# EAGLE design FPGA Interface Board (EAGLE 6.5.0)
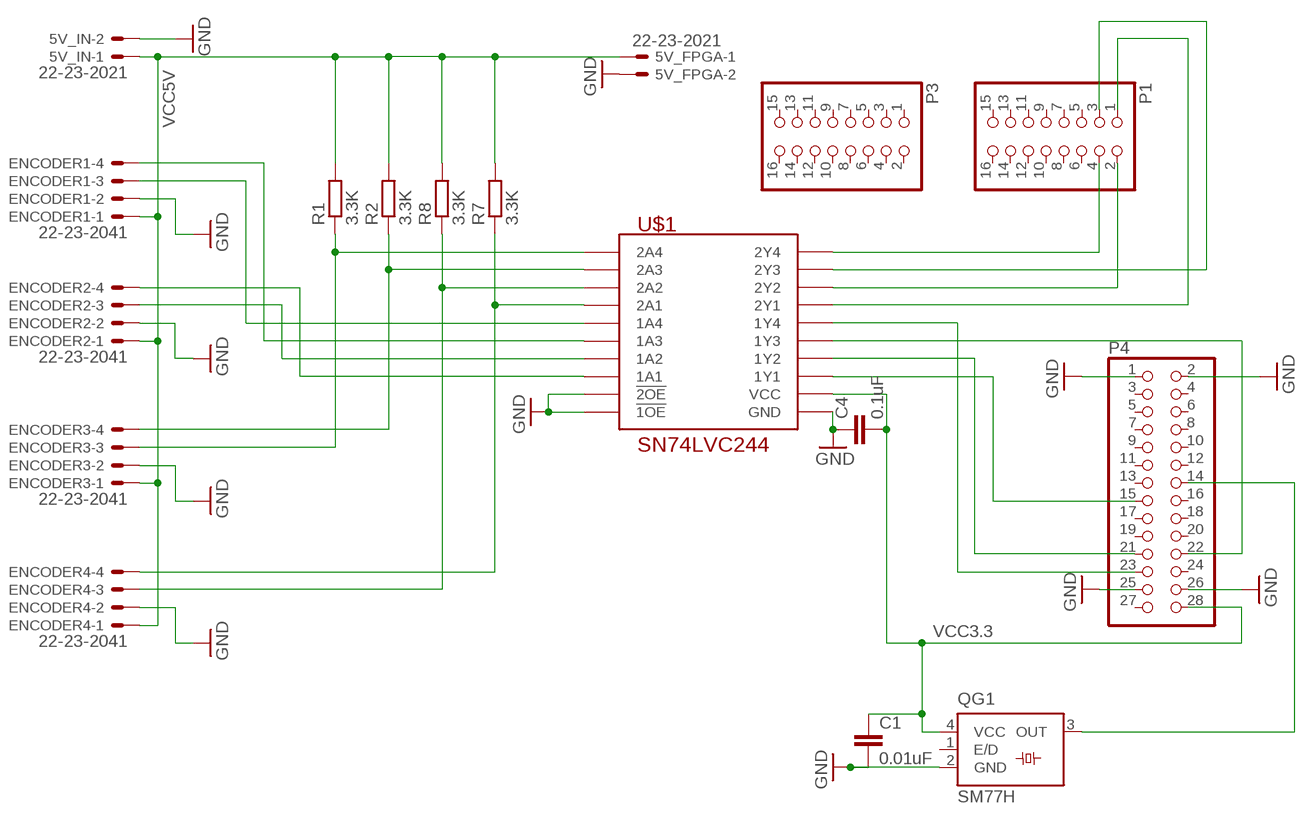
[diagram p0: schematic, sheet 1]

## Parts
5V_FPGA  22-23-2021  [22-23-2021]
5V_IN  22-23-2021  [22-23-2021]
C1  0.01uF  C-EUC0603  [C0603]
C4  0.1uF  C-EUC0603  [C0603]
ENCODER1  22-23-2041  [22-23-2041]
ENCODER2  22-23-2041  [22-23-2041]
ENCODER3  22-23-2041  [22-23-2041]
ENCODER4  22-23-2041  [22-23-2041]
P1  PINHD-2X8  [2X08]
P3  PINHD-2X8  [2X08]
P4  PINHD-2X14  [2X14]
QG1  SM77H  [SM77H]
R1  3.3K  R-EU_R0603  [R0603]
R2  3.3K  R-EU_R0603  [R0603]
R7  3.3K  R-EU_R0603  [R0603]
R8  3.3K  R-EU_R0603  [R0603]
U$1  SN74LVC244  [TSSOP-20-0.65MM]

## Nets
GND: 5V_FPGA.2 5V_IN.2 C1.2 C4.1 ENCODER1.2 ENCODER2.2 ENCODER3.2 ENCODER4.2 P4.1 P4.2 P4.25 P4.26 QG1.2(GND) U$1.P$1(!1OE) U$1.P$10(GND) U$1.P$19(!2OE)
N$1: P4.14 QG1.3(OUT)
N$2: P4.23 U$1.P$12(1Y4)
N$3: P4.21 U$1.P$16(1Y2)
N$4: P4.15 U$1.P$18(1Y1)
N$5: P4.22 U$1.P$14(1Y3)
N$6: P1.4 U$1.P$3(2Y4)
N$7: P1.2 U$1.P$7(2Y2)
N$8: P1.1 U$1.P$9(2Y1)
N$9: P1.3 U$1.P$5(2Y3)
N$10: ENCODER3.3 R1.1 U$1.P$17(2A4)
N$11: ENCODER3.4 R2.1 U$1.P$15(2A3)
N$14: ENCODER4.3 R8.1 U$1.P$13(2A2)
N$15: ENCODER4.4 R7.1 U$1.P$11(2A1)
N$16: ENCODER1.3 U$1.P$8(1A4)
N$17: ENCODER1.4 U$1.P$6(1A3)
N$18: ENCODER2.3 U$1.P$4(1A2)
N$19: ENCODER2.4 U$1.P$2(1A1)
VCC3.3: C1.1 C4.2 P4.28 QG1.4(VCC) U$1.P$20(VCC)
VCC5V: 5V_FPGA.1 5V_IN.1 ENCODER1.1 ENCODER2.1 ENCODER3.1 ENCODER4.1 R1.2 R2.2 R7.2 R8.2
Unconnected: P1.5 P1.6 P1.7 P1.8 P1.9 P1.10 P1.11 P1.12 P1.13 P1.14 P1.15 P1.16 P3.1 P3.2 P3.3 P3.4 P3.5 P3.6 P3.7 P3.8 P3.9 P3.10 P3.11 P3.12 P3.13 P3.14 P3.15 P3.16 P4.3 P4.4 P4.5 P4.6 P4.7 P4.8 P4.9 P4.10 P4.11 P4.12 P4.13 P4.16 P4.17 P4.18 P4.19 P4.20 P4.24 P4.27 QG1.1(E/D)

## Library data of the parts
5V_FPGA 5V_IN = con-molex:22-23-2021: .100" (2.54mm) Center Header - 2 Pin; MF: MOLEX; MPN: 22-23-2021; OC_FARNELL: 1462926; OC_NEWARK: 25C3832
C1 C4 = rcl:C-EU: CAPACITOR, European symbol
ENCODER1-ENCODER4 = con-molex:22-23-2041: .100" (2.54mm) Center Header - 4 Pin; MF: MOLEX; MPN: 22-23-2041; OC_FARNELL: 1462920; OC_NEWARK: 38C0355
P1 P3 = pinhead:PINHD-2X8: PIN HEADER
P4 = pinhead:PINHD-2X14: PIN HEADER
QG1 = custom:SM77H: 3.3V CMOS Clock Oscillator Source: www.pletronics.com .. sm77h%203.3v.pdf; OC_FARNELL: unknown; OC_NEWARK: unknown
R1 R2 R7 R8 = rcl:R-EU_: RESISTOR, European symbol
U$1 = custom:SN74LVC244

## Board
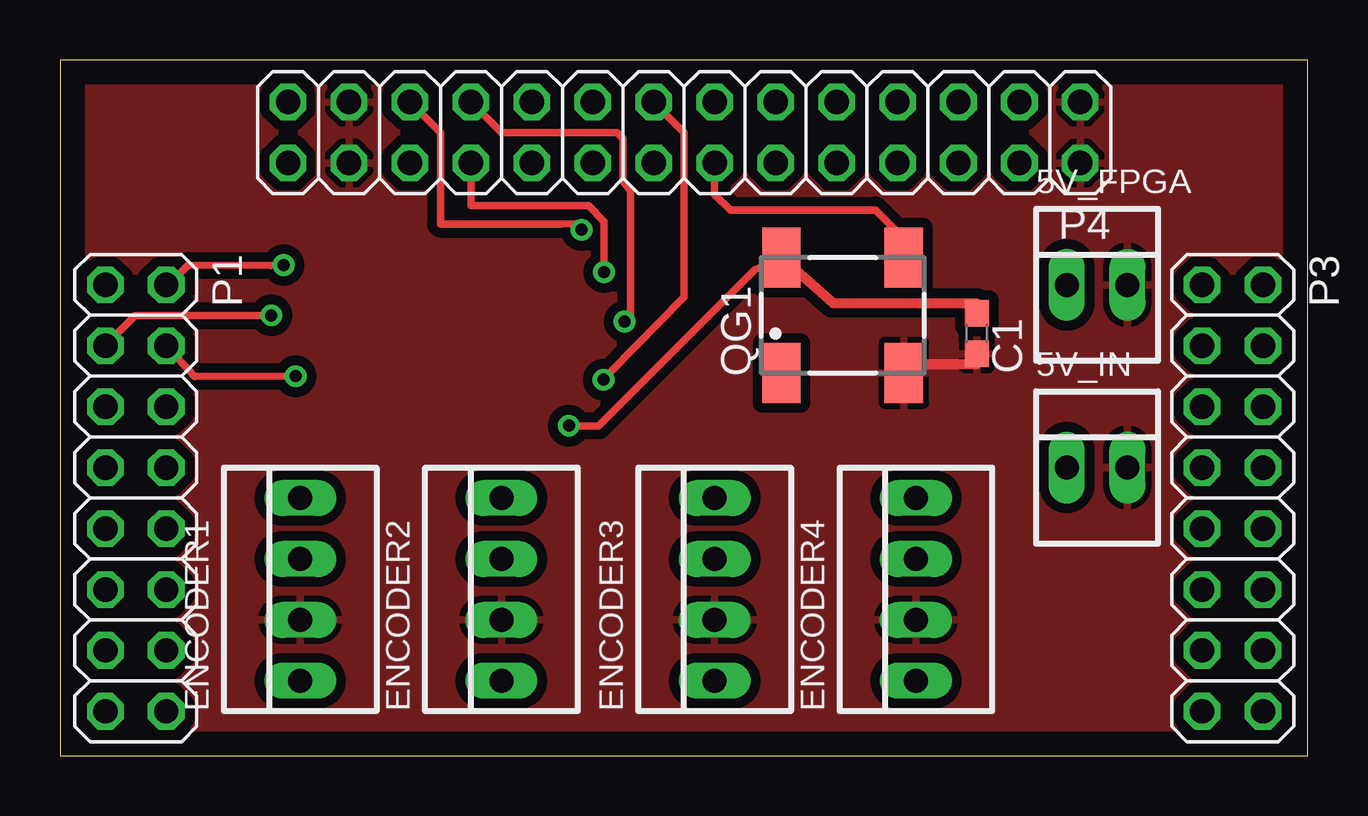
[diagram p1: board, top side]
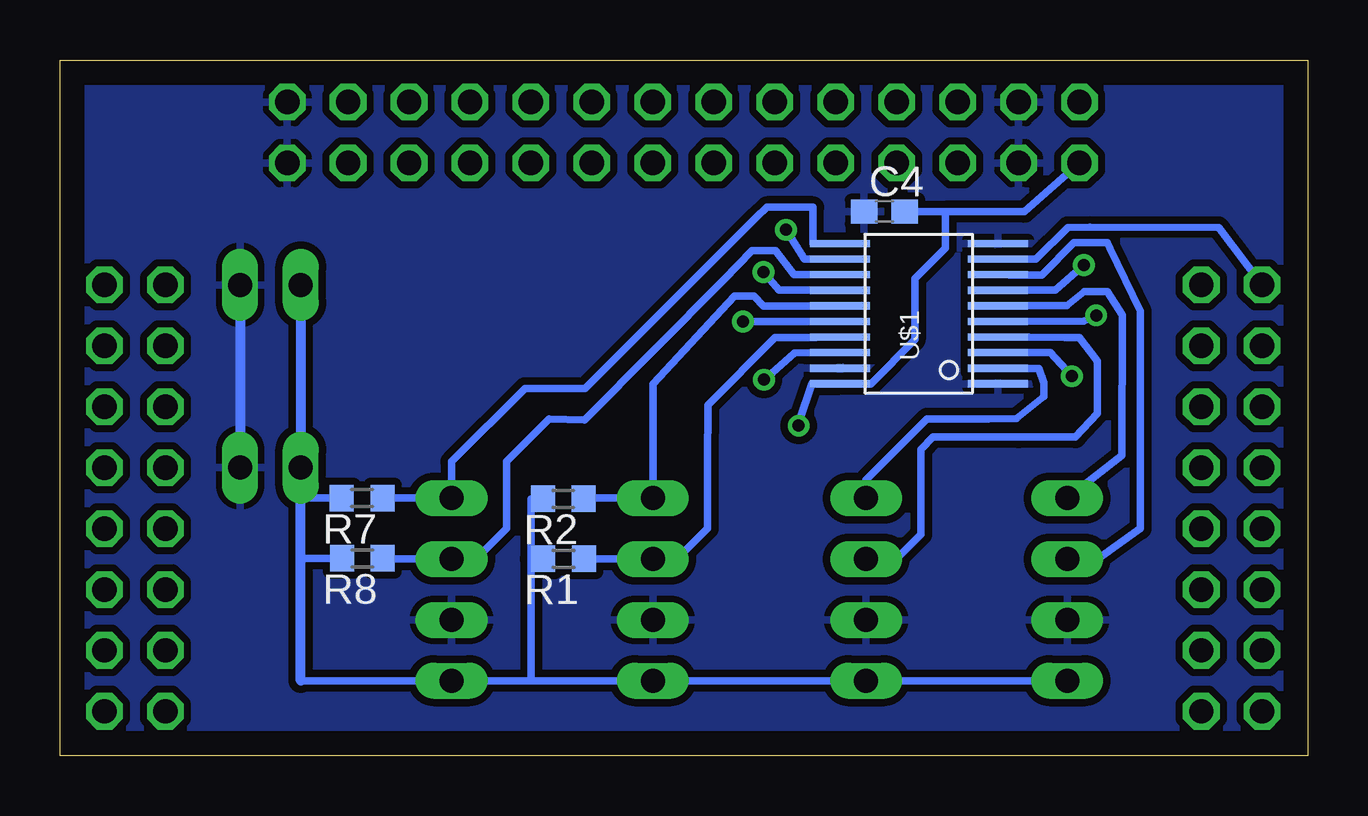
[diagram p2: board, bottom side, seen from below]

Size 52 x 29 mm. Coordinates in mm from the lower left corner, seen from the top.
Outline: 0,0 52,0 52,29 0,29 0,0
Copper layers (1*16): Top 0.035mm / dielectric 1.5mm / Bottom 0.035mm
Design rules "default *": minimum track width 8mil, minimum drill 0.3mm, track to track 8mil, track to pad 8mil, pad to pad 8mil, via to via 8mil, smd to smd 8mil, copper to edge 40mil, drill to drill 8mil, minimum pad ring 10mil, minimum via ring 8mil, stop-mask expansion 4mil, vias tented up to drill 0mil, thermal gap 10mil

### Footprints (pad centres in the part's own frame; a part is rotated, then mirrored left to right if it is on the bottom)
22-23-2021 = drill 1 long: 1 -1.27,0; 2 1.27,0
C0603 = smd 1.1 x 1: 1 -0.85,0; 2 0.85,0
22-23-2041 = drill 1 long: 1 -3.81,0; 2 -1.27,0; 3 1.27,0; 4 3.81,0
2X08 = drill 1.016 octagon: 1 -8.89,-1.27; 2 -8.89,1.27; 3 -6.35,-1.27; 4 -6.35,1.27; 5 -3.81,-1.27; 6 -3.81,1.27; 7 -1.27,-1.27; 8 -1.27,1.27; 9 1.27,-1.27; 10 1.27,1.27; 11 3.81,-1.27; 12 3.81,1.27; 13 6.35,-1.27; 14 6.35,1.27; 15 8.89,-1.27; 16 8.89,1.27
2X14 = drill 1.016 octagon: 1 -16.51,-1.27; 2 -16.51,1.27; 3 -13.97,-1.27; 4 -13.97,1.27; 5 -11.43,-1.27; 6 -11.43,1.27; 7 -8.89,-1.27; 8 -8.89,1.27; 9 -6.35,-1.27; 10 -6.35,1.27; 11 -3.81,-1.27; 12 -3.81,1.27; 13 -1.27,-1.27; 14 -1.27,1.27; 15 1.27,-1.27; 16 1.27,1.27; 17 3.81,-1.27; 18 3.81,1.27; 19 6.35,-1.27; 20 6.35,1.27; 21 8.89,-1.27; 22 8.89,1.27; 23 11.43,-1.27; 24 11.43,1.27; 25 13.97,-1.27; 26 13.97,1.27; 27 16.51,-1.27; 28 16.51,1.27
SM77H = smd 1.6 x 2.5: 1 -2.55,-2.4; 2 2.55,-2.4; 3 2.55,2.4; 4 -2.55,2.4
R0603 = smd 1 x 1.1: 1 -0.85,0; 2 0.85,0
TSSOP-20-0.65MM = smd 0.3 x 2.5: P$1 -2.925,-3.3; P$2 -2.275,-3.3; P$3 -1.625,-3.3; P$4 -0.975,-3.3; P$5 -0.325,-3.3; P$6 0.325,-3.3; P$7 0.975,-3.3; P$8 1.625,-3.3; P$9 2.275,-3.3; P$10 2.925,-3.3; P$11 2.925,3.3; P$12 2.275,3.3; P$13 1.625,3.3; P$14 0.975,3.3; P$15 0.325,3.3; P$16 -0.325,3.3; P$17 -0.975,3.3; P$18 -1.625,3.3; P$19 -2.275,3.3; P$20 -2.925,3.3

### Placement (x,y rotation side)
5V_FPGA  43.23,19.62 0 top
5V_IN  43.23,12 0 top
C1  38.21,17.59 270 top
C4  17.64,22.67 0 bottom
ENCODER1  10.02,6.92 90 top
ENCODER2  18.4,6.92 90 top
ENCODER3  27.29,6.92 90 top
ENCODER4  35.68,6.92 90 top
P1  3.16,10.73 270 top
P3  48.88,10.73 270 top
P4  26.02,25.97 180 top
QG1  32.62,18.35 0 top
R1  31.01,8.21 180 bottom
R2  31.02,10.7 180 bottom
R7  39.4,10.73 180 bottom
R8  39.4,8.22 180 bottom
U$1  16.2,18.42 90 bottom

### Tracks (layer width: path | path; a pad name or v marks a point on that pad's centre or on a via)
GND
  Top 0.406: QG1.2 36.07,16.32 38.21,16.32 C1.2
  Bottom 0.406: 5V_FPGA.2 5V_IN.2
  pour Bottom (isolate 0.305): 0,28 0,0 51,0 51,28
  pour Top (isolate 0.406): 0,28 51,28 51,0 0,0
N$1
  Top 0.305: QG1.3 35.17,21.55 33.98,22.75 27.94,22.75 27.29,23.39 P4.14
N$2  (via drill 0.5)
  Top 0.305: P4.23 15.86,25.98 15.86,22.16 20.91,22.16 21.53,22.17 v21.74,21.92
  Bottom 0.305: v21.74,21.92 20.97,20.7 U$1.P$12
N$3  (via drill 0.5)
  Top 0.305: P4.21 18.4,25.98 23.22,25.98 23.48,25.72 23.48,23.94 23.79,23.53 23.79,18.77 23.79,18.32 v23.53,18.09
  Bottom 0.305: v23.53,18.09 22.5,18.09 U$1.P$16
N$4  (via drill 0.5)
  Top 0.305: P4.15 26.02,25.98 26.02,19.12 22.94,15.98 v22.65,15.67
  Bottom 0.305: U$1.P$18 21.39,16.79 22.32,15.95 22.33,15.93 v22.65,15.67
N$5  (via drill 0.5)
  Top 0.305: P4.22 17.13,22.93 21.57,22.93 22.04,22.93 22.68,22.25 v22.68,20.15
  Bottom 0.305: v22.68,20.15 22.03,19.4 U$1.P$14
N$6  (via drill 0.5)
  Top 0.305: P1.4 5.61,15.8 v9.82,15.81
  Bottom 0.305: v9.82,15.81 10.72,16.8 11.47,16.8 U$1.P$3
N$7  (via drill 0.5)
  Top 0.305: P1.2 4.49,19.62 5.35,20.45 8.79,20.44 v9.32,20.45
  Bottom 0.305: v9.32,20.45 10.52,19.4 11.41,19.4 U$1.P$7
N$8
  Bottom 0.305: P1.1 3.71,22.01 9.08,22.03 10,22.02 11.32,20.7 12.63,20.7 U$1.P$9
N$9  (via drill 0.5)
  Top 0.305: P1.3 3.14,18.34 5.58,18.34 8.17,18.34 v8.81,18.35
  Bottom 0.305: U$1.P$5 12.69,18.1 12.56,18.1 12.55,18.09 9.33,18.11 v8.81,18.35
N$10
  Bottom 0.305: U$1.P$17 20.49,17.43 22.2,17.43 24.99,14.62 25,12.22 25,9.46 26.27,8.2 ENCODER3.3 30.14,8.2 R1.1
N$11
  Bottom 0.305: U$1.P$15 22.67,18.74 23.08,19.16 23.88,19.15 27.29,15.48 ENCODER3.4 30.14,10.73 R2.1
N$14
  Bottom 0.305: U$1.P$13 20.47,20.05 21.4,20.05 22.18,21.05 23.15,21.05 24.32,19.85 30.13,13.99 31.61,14.04 33.38,12.26 33.38,9.46 34.65,8.2 ENCODER4.3 38.52,8.2 R8.1
N$15
  Bottom 0.305: U$1.P$11 20.61,21.35 20.61,22.86 22.54,22.86 22.96,22.46 30.11,15.31 32.62,15.31 35.68,12.25 ENCODER4.4 R7.1
N$16
  Bottom 0.305: U$1.P$8 12.42,20.03 11.07,20.04 9.73,21.39 8.34,21.38 8.24,21.15 6.97,18.53 6.97,9.46 8.75,8.2 ENCODER1.3
N$17
  Bottom 0.305: U$1.P$6 12.43,18.76 10.03,18.76 9.3,19.35 8.34,19.34 7.71,18.37 7.74,12.52 ENCODER1.4
N$18
  Bottom 0.305: U$1.P$4 12.08,17.46 11.62,17.46 10.12,17.43 9.52,17.44 8.76,16.44 8.76,14.26 9.68,13.28 12.05,13.28 15.6,13.28 16.11,12.77 16.11,9.21 17.13,8.2 ENCODER2.3 18.41,8.21
N$19
  Bottom 0.305: U$1.P$2 12.43,16.14 11.2,16.14 10.99,15.52 10.99,14.96 12.14,14.05 13.31,14.04 15.86,14.04 18.4,11.5 ENCODER2.4
VCC3.3  (via drill 0.5)
  Top 0.305: QG1.4 28.96,20.25 22.45,13.74 21.4,13.74 v21.21,13.76
  Top 0.406: QG1.4 32.23,18.86 38.21,18.86 C1.1
  Bottom 0.305: P4.28 11.79,22.67 15.1,22.67 | 15.1,22.67 15.1,21.15 16.37,19.88 16.37,17.34 18.2,15.5 U$1.P$20 20.14,15.5 20.65,15.52 21.2,13.91 v21.21,13.76 | C4.2 15.1,22.67
VCC5V
  Bottom 0.305: 41.96,10.74 41.95,10.73 R7.2 | R8.2 41.96,8.22 | R2.2 32.37,10.69 32.37,8.2 | 32.37,8.2 32.37,8.21 R1.2 32.37,8.2 | 32.37,8.2 32.37,3.12 | ENCODER1.1 ENCODER2.1 ENCODER3.1 32.37,3.12 | 41.96,3.12 ENCODER4.1 32.37,3.12
  Bottom 0.406: 5V_FPGA.1 5V_IN.1 41.96,10.74 41.96,8.22 41.96,3.12